# Altium schematic sheet INPUT_LOGIC.SchDoc: Input logic
size 297 x 209 mm; CheckedBy: -; CompanyName: CERN; DrawnBy: GK, TW; Organization: CERN; Address1: European Organization for Nuclear Research; Address2: CH-1211 Geneve 23 - Switzerland; DocumentNumber: 5; Revision: -; SheetNumber: 6; SheetTotal: 9; EDA_Number: EDA-02667-V2-0; Projet: FMC Delay 1ns 4cha; ModifiedBy: -; CheckedDate: -; DivGrp: BE-CO; Designer: GK, TW; ModifiedDate: -
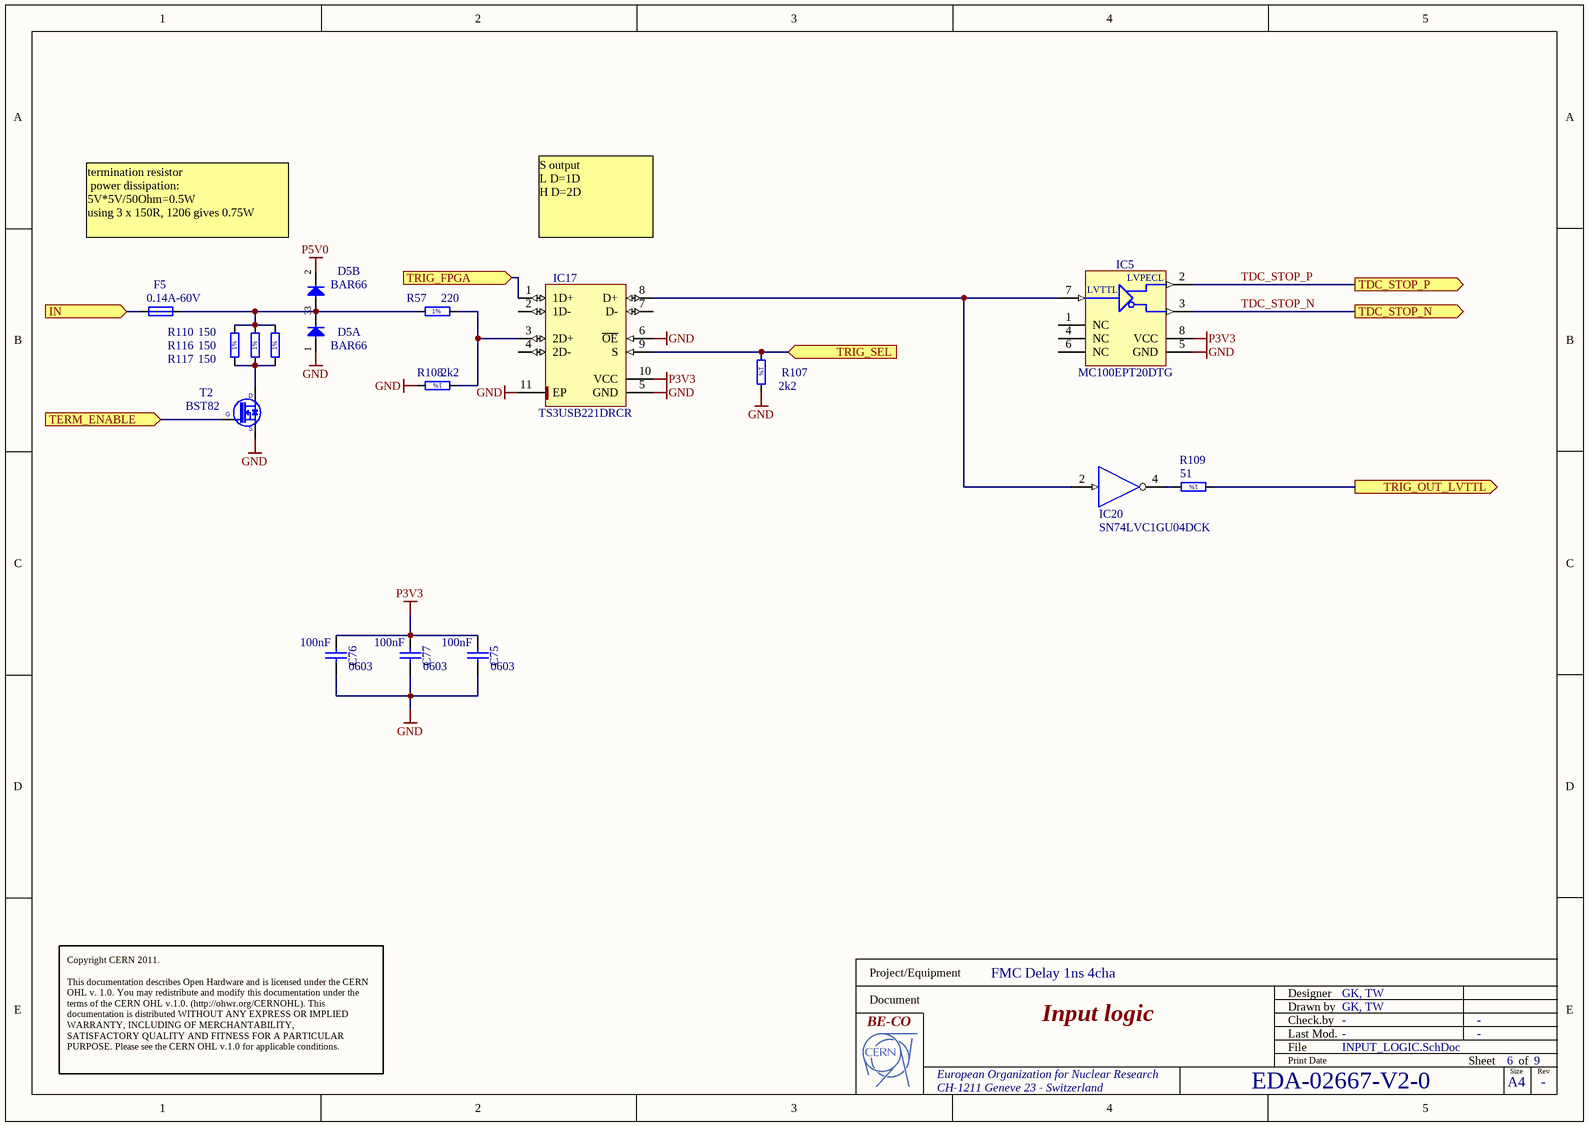
[diagram p0: INPUT_LOGIC.SchDoc]

## Parts
C75  100nF  Case: 0603  [CAPC1608X87N]
C76  100nF  Case: 0603  [CAPC1608X87N]
C77  100nF  Case: 0603  [CAPC1608X87N]
D5  BAR66  [SOT95P240X110-3N]  (parts A,B of 2)
F5  0.14A-60V  [FUSRC4632X90N]
IC5  MC100EPT20DTG  [SOP65P490X110-8N]
IC17  TS3USB221DRCR  [SON50P300X300X100-11N-R175X250]
IC20  SN74LVC1GU04DCK  [SOT65P210X110-5N]
R57  220  [RESC1608X55N]
R107  2k2  [RESC1608X55N]
R108  2k2  [RESC1608X55N]
R109  51  [RESC1608X55N]
R110  150  [RESC3216X65N]
R116  150  [RESC3216X65N]
R117  150  [RESC3216X65N]
T2  BST82  [SOT95P240X110-3N]

## Ports
IN (in), TDC_STOP_N (out), TDC_STOP_P (out), TERM_ENABLE (in), TRIG_FPGA (in), TRIG_OUT_LVTTL (out), TRIG_SEL (in)

## Nets
GND: C75.2 C76.2 C77.2 D5.1(A) IC5.5(GND) IC17.5(GND) IC17.6(~{OE}) IC17.11(EP) IC20.3(GND) R107.2 R108.2 T2.2(S)
P3V3: C75.1 C76.1 C77.1 IC5.8(VCC) IC17.10(VCC) IC20.5(VCC)
P5V0: D5.2(C)
IN: F5.1 ; port IN
TDC_STOP_N: IC5.3(~{Q}) ; port TDC_STOP_N
TDC_STOP_P: IC5.2(Q) ; port TDC_STOP_P
TERM_ENABLE: T2.1(G) ; port TERM_ENABLE
TRIG_FPGA: IC17.1(1D+) ; port TRIG_FPGA
TRIG_OUT_LVTTL: R109.1 ; port TRIG_OUT_LVTTL
TRIG_SEL: IC17.9(S) R107.1 ; port TRIG_SEL
NetD5_3: D5.3(COMAC) F5.2 R57.1 R110.2 R116.2 R117.2
NetIC5_7: IC5.7(D) IC17.8(D+) IC20.2(IN)
NetIC17_3: IC17.3(2D+) R57.2 R108.1
NetIC20_4: IC20.4(OUT) R109.2
NetR110_1: R110.1 R116.1 R117.1 T2.3(D)

Not connected (* = marked no-connect by the designer): IC5 1(NC) 4(NC) 6(NC); IC17 2(1D-) 4(2D-) 7(D-)

## Notes on the sheet
- termination resistor
  power dissipation:
  5V*5V/50Ohm=0.5W
  using 3 x 150R, 1206 gives 0.75W
- S	output
  L	D=1D
  H	D=2D
- Copyright CERN 2011.
  This documentation describes Open Hardware and is licensed under the CERN OHL v. 1.0. You may redistribute and modify this documentation under the terms of the CERN OHL v.1.0. (http://ohwr.org/CERNOHL). This documentation is distributed WITHOUT ANY EXPRESS OR IMPLIED WARRANTY, INCLUDING OF MERCHANTABILITY, SATISFACTORY QUALITY AND FITNESS FOR A PARTICULAR PURPOSE. Please see the CERN OHL v.1.0 for applicable conditions.
- Project/Equipment
- Document
- Designer
- Drawn by
- Check.by
- File
- Last Mod.
- Print Date
- Sheet
- Size
- A4
- of
- Rev
- (in symbol MC100EPT20DTG) LVPECL; LVTTL
- (in symbol R0603_2K2_1%_0.1W_100PPM) 1%
- (in symbol R0603_51R_1%_0.1W_100PPM) 1%
- (in symbol R0603_220R_1%_0.1W_100PPM) 1%
- (in symbol R1206_150R_1%_0.25W_100PPM) 1%

## Library data of the parts
C75-C77 = CC0603_100NF_50V_10%_X7R: Non-polarised capacitor; Part Description: SMD Multilayer Chip Ceramic Capacitor; Manufacturer: GENERIC; Manufacturer1 Part Number: 223858615649; Voltage: 50V; TC: X7R; Tolerance: ±10%; Table: Capacitors SMD; Part Number: CC0603_100NF_50V_10%_X7R; Component Kind: Standard; Component Type: Standard; Pin Count: 2; Value: 100nF; Status: Preferred; Manufacturer Part Number: CC0603_100NF_50V_10%_X7R; Mounted: Yes; Socket: No; SMD: Yes; Manufacturer1 Example: PHYCOMP; Manufacturer1 ComponentHeight: 0.87mm; HelpURL: \\cern.ch\dfs\Applications\Altium\Datasheets\CC0603_X7R_PHYCOMP.pdf; Author: CERN DEM JLC; CreateDate: 12/3/2007; LatestRevisionDate: 12/3/2007
D5 = BAR66: Serial Diode; Part Description: Silicon PIN Diode Array (Series Connected); Manufacturer: INFINEON; Voltage: 150V; Power: 250mA; Table: Diodes; Part Number: BAR66; Component Kind: Standard; Component Type: Standard; Device: BAR66; PackageDescription: SOT23 3-Leads, Pitch 0.95mm - Body 1.3x2.9mm, IPC Medium Density; Manufacturer Part Number: BAR66; Pin Count: 3; Case: SOT23; Mounted: Yes; Socket: No; SMD: Yes; ComponentHeight: 1.1mm; HelpURL: \\cern.ch\dfs\Applications\Altium\Datasheets\BAR66.pdf; Author: CERN DEM JLC; CreateDate: 1/18/2010; LatestRevisionDate: 10/5/2010
F5 = FUSR1812_TYCO-miniSMD0114F: Fuse; Part Description: PolySwitch® PTC Overcurrent Protection Device; Manufacturer: TYCO ELECTRONICS; Manufacturer Part Number: miniSMDC014F; Table: Fuses; Part Number: FUSR1812_TYCO-miniSMD0114F; Component Kind: Standard; Component Type: Standard; Pin Count: 2; PackageDescription: Chip Resettable Fuse, 2-Leads, Body 4.6x3.2mm, IPC Medium Density; Family: Fuses Resettable; Mounted: Yes; Socket: No; SMD: Yes; Value: 0.14A-60V; ComponentHeight: 0.89mm; HelpURL: \\cern.ch\dfs\Applications\Altium\Datasheets\FUSR_TYCO_MiniSMD0114F.pdf; Author: CERN DEM JLC; CreateDate: 7/2/2008; LatestRevisionDate: 3/17/2010
IC5 = MC100EPT20DTG: 3.3V LVTTL/LVCMOS to Differential LVPECL Translator; Manufacturer: ON SEMICONDUCTOR; Table: Standard Logic; Part Number: MC100EPT20DTG; Component Kind: Standard; Component Type: Standard; Device: MC100EPT20DTG; PackageDescription: SOP, 0.65mm pitch; 8 pin, 3.00mm W X 3.00mm L X 1.10mm H body, IPC Medium Density; Part Description: 3.3V LVTTL/LVCMOS To Differential LVPECL Translator; Manufacturer Part Number: MC100EPT20DTG; Pin Count: 8; Case: SOIC8; Mounted: Yes; Socket: No; SMD: Yes; ComponentHeight: 1.1mm; Author: CERN DEM JLC; HelpURL: \\cern.ch\dfs\Applications\Altium\Datasheets\MC100EPT20DTG.pdf; CreateDate: 7/5/2010; LatestRevisionDate: 7/5/2010
IC17 = TS3USB221DRCR: High-Speed USB 2.0 (480-Mbps) 1:2 Multiplexer/Demultiplexer Switch With Single Enable; Manufacturer: TEXAS INSTRUMENTS; Table: Analog & Interface; Part Number: TS3USB221DRCR; Component Kind: Standard; Component Type: Standard; Device: TS3USB221DRCR; PackageDescription: SON, 0.50mm Pitch, 10-pin, 3.00mm W  X 3.00mm L X 1.00mm Height, (w/thermal tab 1.75 X 2.50 mm), IPC Medium Density; Part Description: High-Speed USB 2.0 (480-Mbps) 1:2 Multiplexer/Demultiplexer Switch With Single Enable; Manufacturer Part Number: TS3USB221DRCR; Pin Count: 11; Case: SON10; Mounted: Yes; Socket: No; SMD: Yes; ComponentHeight: 1mm; Author: CERN DEM JLC; HelpURL: \\cern.ch\dfs\Applications\Altium\Datasheets\TS3USB221DRCR.pdf; CreateDate: 8/25/2010; LatestRevisionDate: 8/25/2010
IC20 = SN74LVC1GU04DCK: Single Inverter Buffer; Part Description: Single Inverter Gate; Manufacturer: TEXAS INSTRUMENTS; Table: Standard Logic; Part Number: SN74LVC1GU04DCK; Component Kind: Standard; Component Type: Standard; Device: SN74LVC1GU04DCK; PackageDescription: SOT353, SC70-5, SOT, 0.65mm Pitch, 5 pin, 1.25mm W X 2.00mm L X 1.10mm H, IPC Medium Density; Manufacturer Part Number: SN74LVC1GU04DCK; Pin Count: 2; Case: SOT353; Mounted: Yes; Socket: No; SMD: Yes; ComponentHeight: 1.1mm; Author: CERN DEM JLC; HelpURL: \\cern.ch\dfs\Applications\Altium\Datasheets\SN74LVC1GU04DCK.pdf; CreateDate: 2/16/2011; LatestRevisionDate: 2/16/2011
R57 = R0603_220R_1%_0.1W_100PPM: Resistor - 1%; Part Description: General Purpose Thick Film Chip Resistor; Manufacturer: GENERIC; Manufacturer1 Part Number: NRC06F2200TRF; Power: 0.1W; TC: ±100ppm/°C; Table: Resistors SMD; Part Number: R0603_220R_1%_0.1W_100PPM; Component Kind: Standard; Component Type: Standard; Pin Count: 2; Value: 220; Status: Preferred; Tolerance: ±1%; Manufacturer Part Number: R0603_220R_1%_0.1W_100PPM; Case: 0603; Mounted: Yes; Socket: No; SMD: Yes; Manufacturer1 Example: NIC COMPONENT; Manufacturer1 ComponentHeight: 0.55mm; HelpURL: \\cern.ch\dfs\Applications\Altium\Datasheets\R0603_NIC_NRC.pdf; Author: CERN DEM JLC; CreateDate: 12/3/2007; LatestRevisionDate: 3/13/2008
R107 R108 = R0603_2K2_1%_0.1W_100PPM: Resistor - 1%; Part Description: General Purpose Thick Film Chip Resistor; Manufacturer: GENERIC; Manufacturer1 Part Number: NRC06F2201TRF; Power: 0.1W; TC: ±100ppm/°C; Table: Resistors SMD; Part Number: R0603_2K2_1%_0.1W_100PPM; Component Kind: Standard; Component Type: Standard; Pin Count: 2; Value: 2k2; Status: Preferred; Tolerance: ±1%; Manufacturer Part Number: R0603_2K2_1%_0.1W_100PPM; Case: 0603; Mounted: Yes; Socket: No; SMD: Yes; Manufacturer1 Example: NIC COMPONENT; Manufacturer1 ComponentHeight: 0.55mm; HelpURL: \\cern.ch\dfs\Applications\Altium\Datasheets\R0603_NIC_NRC.pdf; Author: CERN DEM JLC; CreateDate: 12/3/2007; LatestRevisionDate: 3/13/2008
R109 = R0603_51R_1%_0.1W_100PPM: Resistor - 1%; Part Description: General Purpose Thick Film Chip Resistor; Manufacturer: GENERIC; Manufacturer1 Part Number: NRC06F51R0TRF; Power: 0.1W; TC: ±100ppm/°C; Table: Resistors SMD; Part Number: R0603_51R_1%_0.1W_100PPM; Component Kind: Standard; Component Type: Standard; Pin Count: 2; Value: 51; Status: Preferred; Tolerance: ±1%; Manufacturer Part Number: R0603_51R_1%_0.1W_100PPM; Case: 0603; Mounted: Yes; Socket: No; SMD: Yes; Manufacturer1 Example: NIC COMPONENT; Manufacturer1 ComponentHeight: 0.55mm; HelpURL: \\cern.ch\dfs\Applications\Altium\Datasheets\R0603_NIC_NRC.pdf; Author: CERN DEM JLC; CreateDate: 12/3/2007; LatestRevisionDate: 3/13/2008
R110 R116 R117 = R1206_150R_1%_0.25W_100PPM: Resistor - 1%; Part Description: General Purpose Thick Film Chip Resistor; Manufacturer: GENERIC; Manufacturer1 Part Number: NRC12F1500TRF; Power: 0.25W; TC: ±100ppm/°C; Table: Resistors SMD; Part Number: R1206_150R_1%_0.25W_100PPM; Component Kind: Standard; Component Type: Standard; Pin Count: 2; Value: 150; Status: Preferred; Tolerance: ±1%; Manufacturer Part Number: R1206_150R_1%_0.25W_100PPM; Case: 1206; Mounted: Yes; Socket: No; SMD: Yes; Manufacturer1 Example: NIC COMPONENT; Manufacturer1 ComponentHeight: 0.65mm; HelpURL: \\cern.ch\dfs\Applications\Altium\Datasheets\R1206_NIC_NRC.pdf; Author: CERN DEM JLC; CreateDate: 12/3/2007; LatestRevisionDate: 3/13/2008
T2 = BST82: N-CHANNEL MOSFET WITH DIODE; Part Description: 100V 190mA N-Channel Enhancement Mode Field-Effect Transistor; Manufacturer: NXP SEMICONDUCTORS; Table: Transistors; Part Number: BST82; Component Kind: Standard; Component Type: Standard; Device: BST82; PackageDescription: SOT23 3-Leads, Pitch 0.95mm - Body 1.4x3mm, IPC Medium Density; Manufacturer Part Number: BST82; Pin Count: 3; Case: SOT23-3; Mounted: Yes; Socket: No; SMD: Yes; ComponentHeight: 1.1mm; HelpURL: \\cern.ch\dfs\Applications\Altium\Datasheets\BST82.pdf; Author: CERN DEM JLC; CreateDate: 5/14/2008; LatestRevisionDate: 5/14/2008